# EAGLE design 455_audio (EAGLE 9.6.2)

## Sheet 1 of 2
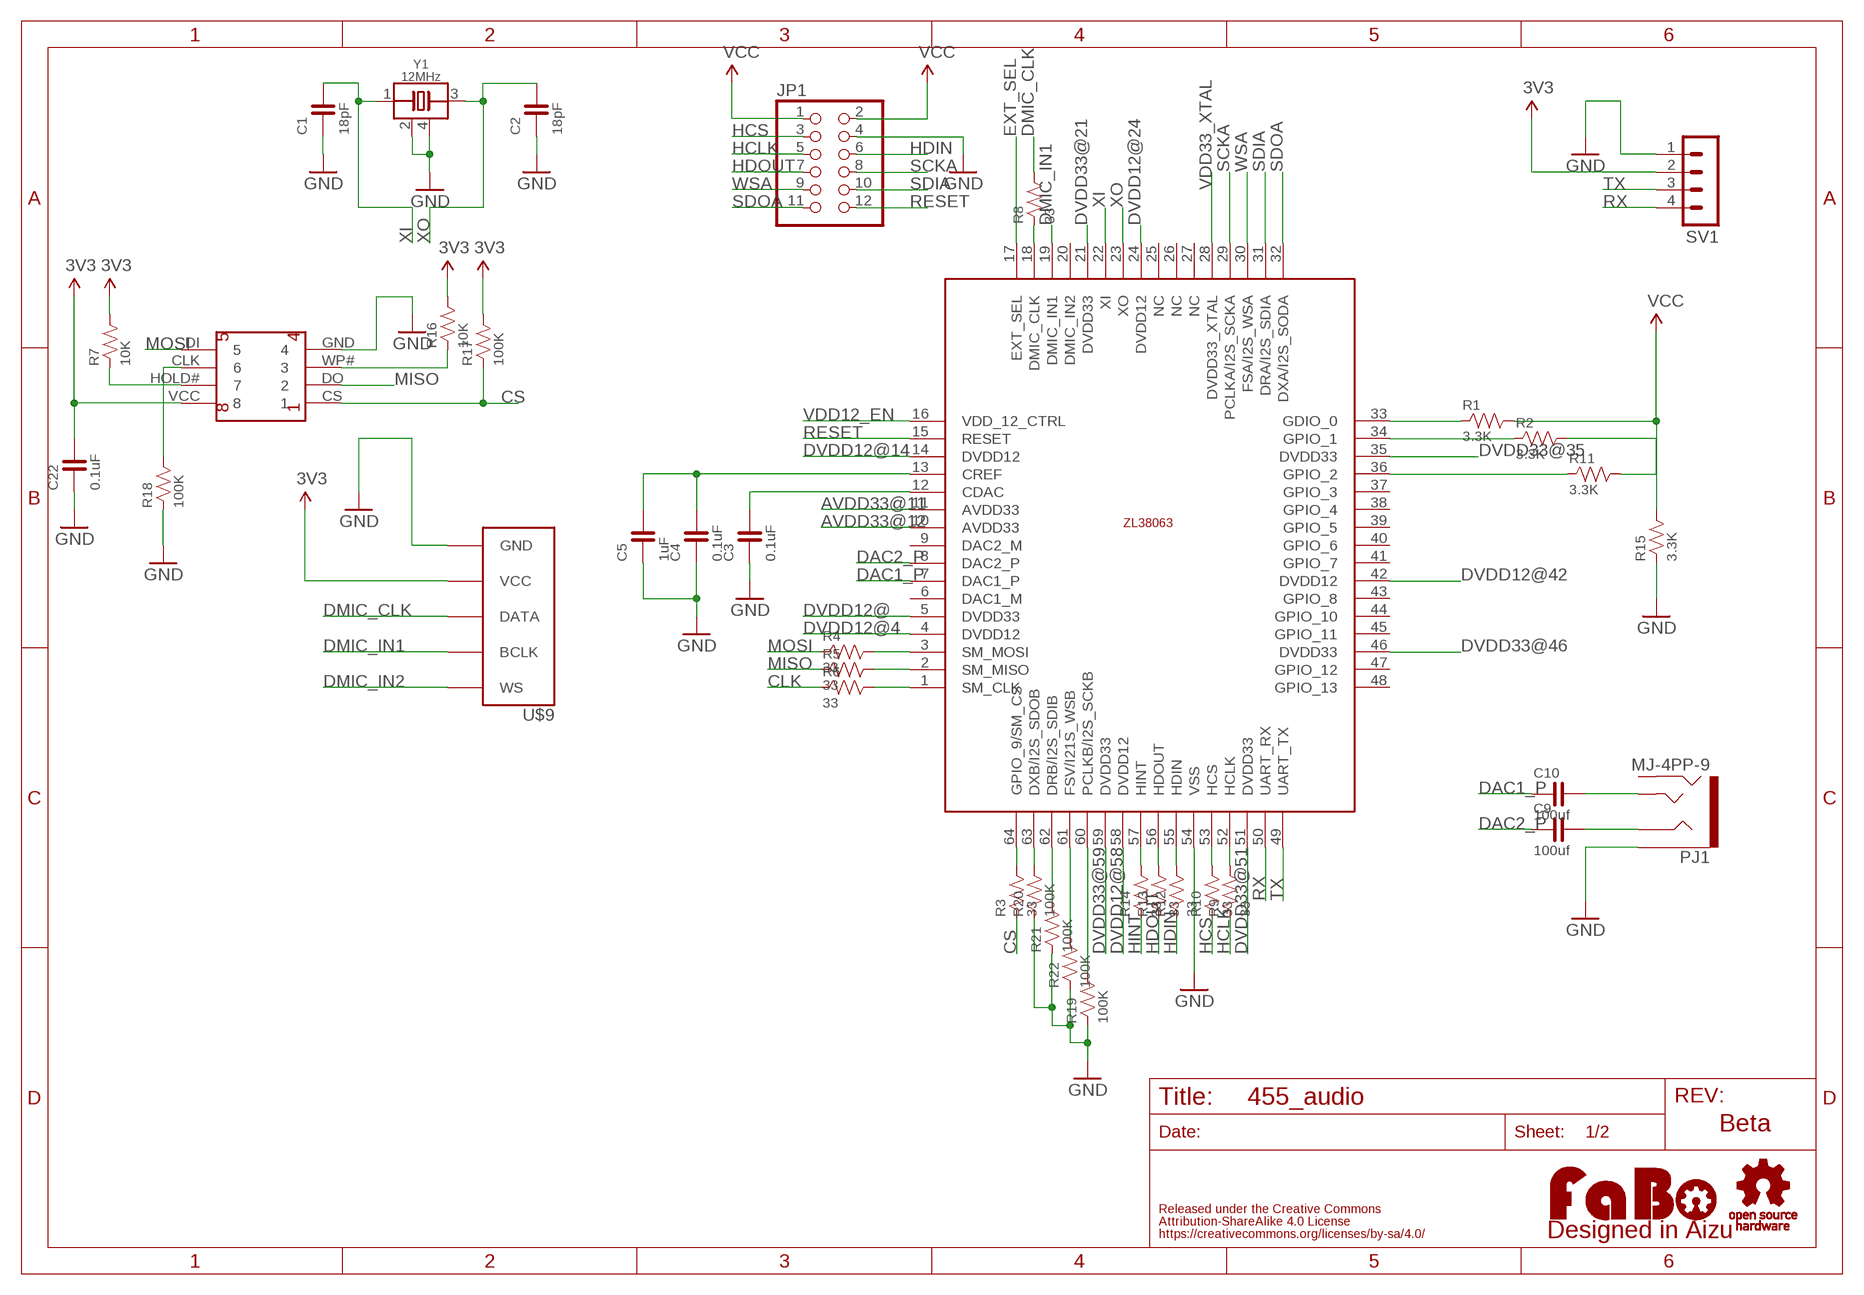
[diagram p0: schematic, sheet 1]

### Parts
C1  18pF  CAPACITOR-0603  [0603]
C2  18pF  CAPACITOR-0603  [0603]
C3  0.1uF  CAPACITOR-0603  [0603]
C4  0.1uF  CAPACITOR-0603  [0603]
C5  1uF  CAPACITOR-0603  [0603]
C9  100uf  CAPACITOR-0603  [0603]
C10  100uf  CAPACITOR-0603  [0603]
C22  0.1uF  CAPACITOR-0603  [0603]
JP1  PINHD-2X6  [2X06]
LOGO1  LOGO_FABO-M  [LOGO_FABO_M]
PJ1  MJ-4PP-9  [PHONEJACK-MJ-4PP-9]
R1  3.3K  RESISTOR-0603  [0603]
R2  3.3K  RESISTOR-0603  [0603]
R3  33  RESISTOR-0603  [0603]
R4  33  RESISTOR-0603  [0603]
R5  33  RESISTOR-0603  [0603]
R6  33  RESISTOR-0603  [0603]
R7  10K  RESISTOR-0603  [0603]
R8  33  RESISTOR-0603  [0603]
R9  33  RESISTOR-0603  [0603]
R10  33  RESISTOR-0603  [0603]
R11  3.3K  RESISTOR-0603  [0603]
R12  33  RESISTOR-0603  [0603]
R13  33  RESISTOR-0603  [0603]
R14  33  RESISTOR-0603  [0603]
R15  3.3K  RESISTOR-0603  [0603]
R16  10K  RESISTOR-0603  [0603]
R17  100K  RESISTOR-0603  [0603]
R18  100K  RESISTOR-0603  [0603]
R19  100K  RESISTOR-0603  [0603]
R20  100K  RESISTOR-0603  [0603]
R21  100K  RESISTOR-0603  [0603]
R22  100K  RESISTOR-0603  [0603]
SV1  MA04-1  [MA04-1]
U$2  ZL38063  [ZL38063]
U$5  LOGO_OSHW-M_BOTTOM  [LOGO_OSHW_M_BOTTOM]
U$6  FLASH-MEMORY-2M(WINBOND)  [FLASH-MEMORY-2M(WINBOND)]
U$9  FABO_BRICK_I2SLONG_BOTTOM  [FABO_BRICK_I2S_S05B-PASK-2_LONG_BOTTOM]
Y1  12MHz  CRYSTAL-ECS-120-12-33Q  [ECS-12MHZ]

### Nets
3V3: C22.2 R7.2 R16.2 R17.2 SV1.2 U$6.VCC U$9.VCC ; also sheet 2
AVDD33@11: U$2.11(AVDD33)
AVDD33@12: U$2.10(AVDD33)
CLK: R6.1 R18.2 U$6.CLK
CS: R3.1 R17.1 U$6.CS
DAC1_P: C10.1 U$2.7(DAC1_P)
DAC2_P: C9.1 U$2.8(DAC2_P)
DMIC_CLK: R8.2 U$9.DATA
DMIC_IN1: U$2.19(DMIC_IN1) U$9.BCLK
DMIC_IN2: U$9.WS
DVDD12@: U$2.5(DVDD33) ; also sheet 2
DVDD12@4: U$2.4(DVDD12) ; also sheet 2
DVDD12@14: U$2.14(DVDD12) ; also sheet 2
DVDD12@24: U$2.24(DVDD12) ; also sheet 2
DVDD12@42: U$2.42(DVDD12) ; also sheet 2
DVDD12@58: U$2.58(DVDD12) ; also sheet 2
DVDD33@21: U$2.21(DVDD33) ; also sheet 2
DVDD33@35: U$2.35(DVDD33) ; also sheet 2
DVDD33@46: U$2.46(DVDD33) ; also sheet 2
DVDD33@51: U$2.51(DVDD33) ; also sheet 2
DVDD33@59: U$2.59(DVDD33) ; also sheet 2
EXT_SEL: U$2.17(EXT_SEL) ; also sheet 2
GND: C1.1 C2.1 C3.1 C4.1 C5.1 C22.1 JP1.4 PJ1.A R15.1 R18.1 R19.1 R20.1 R21.1 R22.1 SV1.1 U$2.54(VSS) U$6.GND U$9.GND Y1.2(GND) Y1.4(GND) ; also sheet 2
HCLK: JP1.5 R9.1
HCS: JP1.3 R10.1
HDIN: JP1.6 R12.1
HDOUT: JP1.7 R13.1
HINT: R14.1
MISO: R5.1 U$6.DO
MOSI: R4.1 U$6.DI
N$1: R1.1 U$2.33(GDIO_0)
N$2: R2.1 U$2.34(GPIO_1)
N$3: C3.2 U$2.12(CDAC)
N$4: C4.2 C5.2 U$2.13(CREF)
N$5: R3.2 U$2.64(GPIO_9/SM_CS)
N$6: R20.2 U$2.63(DXB/I2S_SDOB)
N$7: R11.1 U$2.36(GPIO_2)
N$8: R5.2 U$2.2(SM_MISO)
N$9: R6.2 U$2.1(SM_CLK)
N$10: C9.2 PJ1.C
N$11: C10.2 PJ1.D
N$12: R4.2 U$2.3(SM_MOSI)
N$13: R8.1 U$2.18(DMIC_CLK)
N$14: R14.2 U$2.57(HINT)
N$15: R13.2 U$2.56(HDOUT)
N$16: R12.2 U$2.55(HDIN)
N$17: R10.2 U$2.53(HCS)
N$18: R9.2 U$2.52(HCLK)
N$19: R11.2 R15.2
N$20: R7.1 U$6.HOLD#
N$21: R16.1 U$6.WP#
N$22: R21.2 U$2.62(DRB/I2S_SDIB)
N$23: R22.2 U$2.61(FSV/I21S_WSB)
N$24: R19.2 U$2.60(PCLKB/I2S_SCKB)
RESET: JP1.12 U$2.15(RESET)
RX: SV1.4 U$2.50(UART_RX)
SCKA: JP1.8 U$2.29(PCLKA/I2S_SCKA)
SDIA: JP1.10 U$2.31(DRA/I2S_SDIA)
SDOA: JP1.11 U$2.32(DXA/I2S_SODA)
TX: SV1.3 U$2.49(UART_TX)
VCC: JP1.1 JP1.2 R1.2 R2.2 ; also sheet 2
VDD12_EN: U$2.16(VDD_12_CTRL) ; also sheet 2
VDD33_XTAL: U$2.28(DVDD33_XTAL)
WSA: JP1.9 U$2.30(FSA/I2S_WSA)
XI: C1.2 U$2.22(XI) Y1.1(IO)
XO: C2.2 U$2.23(XO) Y1.3(IO)
Unconnected: PJ1.B U$2.6(DAC1_M) U$2.9(DAC2_M) U$2.20(DMIC_IN2) U$2.25(NC) U$2.26(NC) U$2.27(NC) U$2.37(GPIO_3) U$2.38(GPIO_4) U$2.39(GPIO_5) U$2.40(GPIO_6) U$2.41(GPIO_7) U$2.43(GPIO_8) U$2.44(GPIO_10) U$2.45(GPIO_11) U$2.47(GPIO_12) U$2.48(GPIO_13)

### Notes on the sheet
- Beta

## Sheet 2 of 2
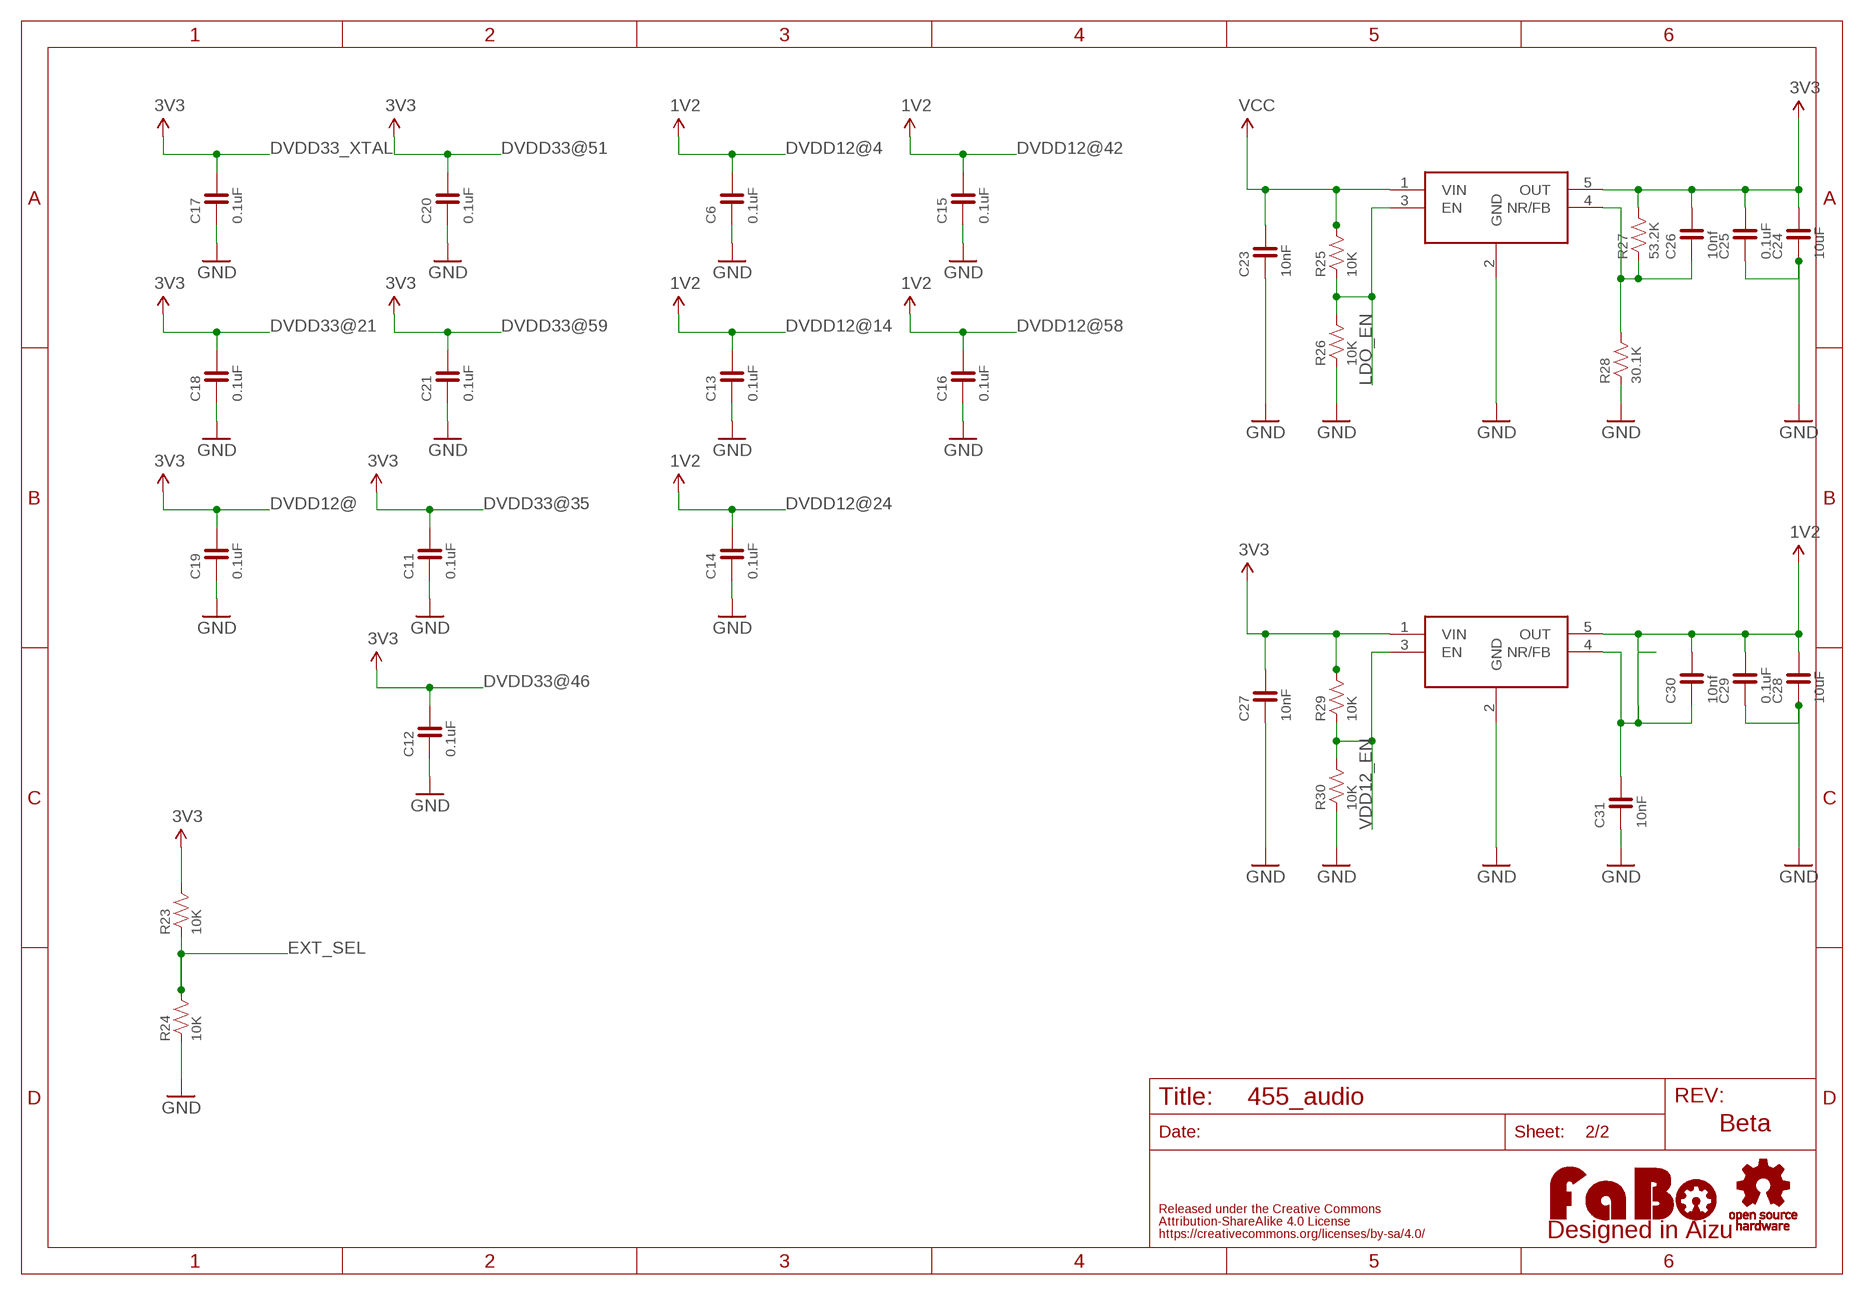
[diagram p1: schematic, sheet 2]

### Parts
C6  0.1uF  CAPACITOR-0603  [0603]
C11  0.1uF  CAPACITOR-0603  [0603]
C12  0.1uF  CAPACITOR-0603  [0603]
C13  0.1uF  CAPACITOR-0603  [0603]
C14  0.1uF  CAPACITOR-0603  [0603]
C15  0.1uF  CAPACITOR-0603  [0603]
C16  0.1uF  CAPACITOR-0603  [0603]
C17  0.1uF  CAPACITOR-0603  [0603]
C18  0.1uF  CAPACITOR-0603  [0603]
C19  0.1uF  CAPACITOR-0603  [0603]
C20  0.1uF  CAPACITOR-0603  [0603]
C21  0.1uF  CAPACITOR-0603  [0603]
C23  10nF  CAPACITOR-0603  [0603]
C24  10uF  CAPACITOR-0603  [0603]
C25  0.1uF  CAPACITOR-0603  [0603]
C26  10nf  CAPACITOR-0603  [0603]
C27  10nF  CAPACITOR-0603  [0603]
C28  10uF  CAPACITOR-0603  [0603]
C29  0.1uF  CAPACITOR-0603  [0603]
C30  10nf  CAPACITOR-0603  [0603]
C31  10nF  CAPACITOR-0603  [0603]
R23  10K  RESISTOR-0603  [0603]
R24  10K  RESISTOR-0603  [0603]
R25  10K  RESISTOR-0603  [0603]
R26  10K  RESISTOR-0603  [0603]
R27  53.2K  RESISTOR-0603  [0603]
R28  30.1K  RESISTOR-0603  [0603]
R29  10K  RESISTOR-0603  [0603]
R30  10K  RESISTOR-0603  [0603]
U$7  TPS73601  [SOT-23-5]
U$8  TPS73601  [SOT-23-5]

### Nets
1V8: C28.2 C29.2 C30.2 U$8.5(OUT) ; supply symbol labelled 1V2
3V3: C24.2 C25.2 C26.2 C27.2 R23.2 R27.2 R29.2 U$7.5(OUT) U$8.1(VIN) ; also sheet 1
DVDD12@: C19.2 ; supply symbol labelled 3V3 ; also sheet 1
DVDD12@4: C6.2 ; supply symbol labelled 1V2 ; also sheet 1
DVDD12@14: C13.2 ; supply symbol labelled 1V2 ; also sheet 1
DVDD12@24: C14.2 ; supply symbol labelled 1V2 ; also sheet 1
DVDD12@42: C15.2 ; supply symbol labelled 1V2 ; also sheet 1
DVDD12@58: C16.2 ; supply symbol labelled 1V2 ; also sheet 1
DVDD33@21: C18.2 ; supply symbol labelled 3V3 ; also sheet 1
DVDD33@35: C11.2 ; supply symbol labelled 3V3 ; also sheet 1
DVDD33@46: C12.2 ; supply symbol labelled 3V3 ; also sheet 1
DVDD33@51: C20.2 ; supply symbol labelled 3V3 ; also sheet 1
DVDD33@59: C21.2 ; supply symbol labelled 3V3 ; also sheet 1
DVDD33_XTAL: C17.2 ; supply symbol labelled 3V3
EXT_SEL: R23.1 R24.2 ; also sheet 1
GND: C6.1 C11.1 C12.1 C13.1 C14.1 C15.1 C16.1 C17.1 C18.1 C19.1 C20.1 C21.1 C23.1 C24.1 C25.1 C27.1 C28.1 C29.1 C31.1 R24.1 R26.1 R28.1 R30.1 U$7.2(GND) U$8.2(GND) ; also sheet 1
LDO_EN: R25.1 R26.2 U$7.3(EN)
N$25: C26.1 R27.1 R28.2 U$7.4(NR/FB)
N$27: C30.1 C31.2 U$8.4(NR/FB)
VCC: C23.2 R25.2 U$7.1(VIN) ; also sheet 1
VDD12_EN: R29.1 R30.2 U$8.3(EN) ; also sheet 1

### Notes on the sheet
- Beta

## Library data of the parts
C1-C6 C9-C31 = FaBo-Capacitor:CAPACITOR: CAPACITOR
JP1 = pinhead:PINHD-2X6: PIN HEADER
LOGO1 = component:LOGO_FABO
PJ1 = FaBo-Parts:MJ-4PP-9: 3.5mm PhoneJack 4 conductor MJ-4PP-9 http://akizukidenshi.com/download/ds/avvicon/MJ-4PP-9.pdf
R1-R30 = FaBo-Resistors:RESISTOR: RESISTOR
SV1 = con-lstb:MA04-1: PIN HEADER; OC_FARNELL: unknown; OC_NEWARK: unknown
U$2 = FaBo-Sound:ZL38063
U$5 = component:LOGO_OSHW
U$6 = FaBo-etc:FLASH-MEMORY-2M(WINBOND)
U$7 U$8 = FaBo-Supply:TPS73601
U$9 = FaBo-Template:FABO_BRICK_I2S
Y1 = FaBo-Crystal:CRYSTAL-ECS

## Board
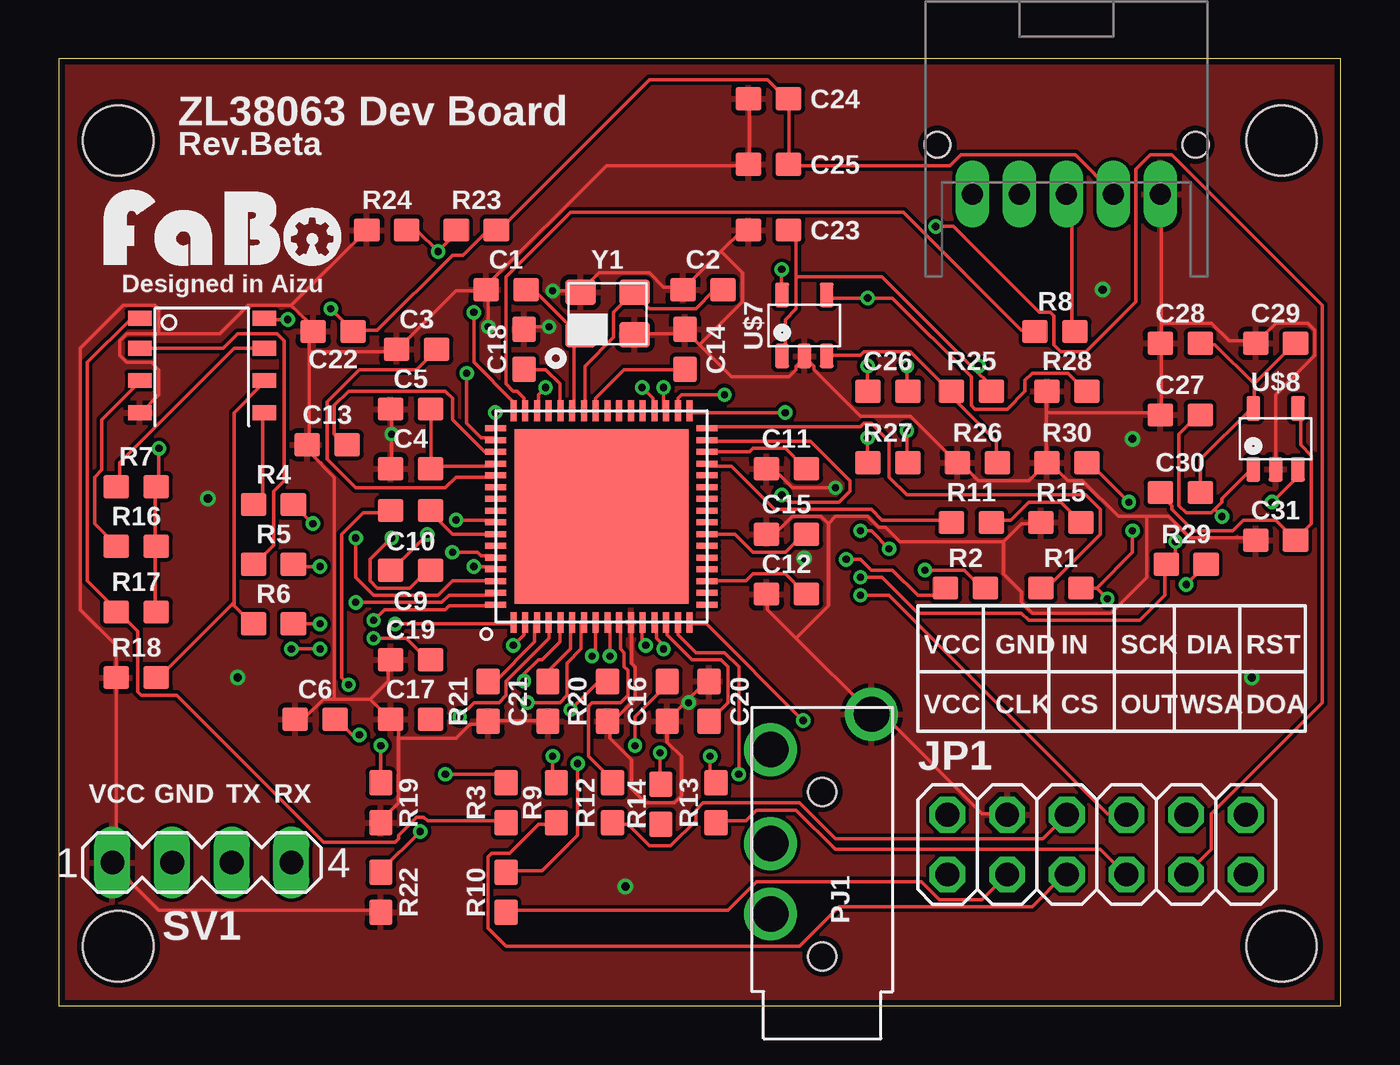
[diagram p2: board, top side]
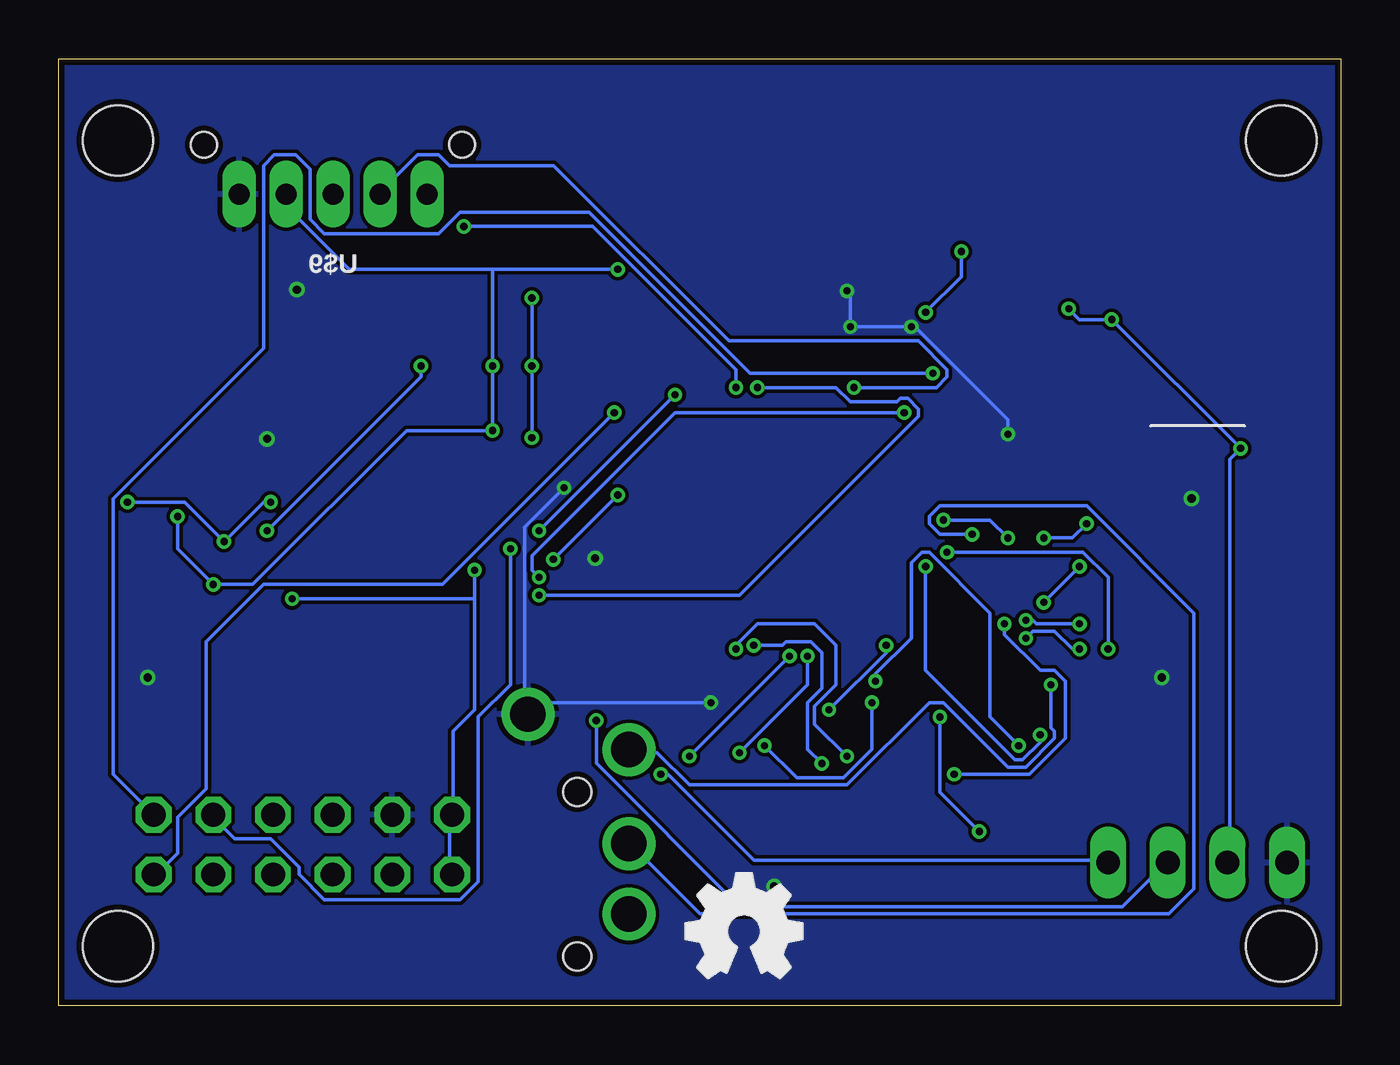
[diagram p3: board, bottom side, seen from below]

Size 54.59 x 40.31 mm. Coordinates in mm from the lower left corner, seen from the top.
Outline: 0,0 54.59,0 54.59,40.31 0,40.31 0,0
Copper layers (1*16): Top 0.035mm / dielectric 1.6mm / Bottom 0.035mm
Design rules "PCBway": minimum track width 6mil, minimum drill 12mil, track to track 6mil, track to pad 6mil, pad to pad 6mil, via to via 6mil, smd to smd 6mil, copper to edge 10mil, drill to drill 10mil, minimum pad ring 10mil, minimum via ring 6mil, stop-mask expansion 2mil, vias tented up to drill 100mil, thermal gap 8mil
Holes 3 mm at 2.54,2.54 2.54,36.83 52.07,36.83 52.07,2.54

### Footprints (pad centres in the part's own frame; a part is rotated, then mirrored left to right if it is on the bottom)
0603 = smd 1.1 x 1: 1 -0.85,0; 2 0.85,0
2X06 = drill 1.016 octagon: 1 -6.35,-1.27; 2 -6.35,1.27; 3 -3.81,-1.27; 4 -3.81,1.27; 5 -1.27,-1.27; 6 -1.27,1.27; 7 1.27,-1.27; 8 1.27,1.27; 9 3.81,-1.27; 10 3.81,1.27; 11 6.35,-1.27; 12 6.35,1.27
PHONEJACK-MJ-4PP-9 = drill 1.5: A 5.8,-2.1; B -2.7,2.2; C 0.3,2.2; D 4.3,2.2 | hole 1.2: -4.5,0; 2.5,0
MA04-1 = drill 1.016 long: 1 -3.81,0; 2 -1.27,0; 3 1.27,0; 4 3.81,0
ZL38063 = smd 0.889 x 0.254: 1 -4.51,-3.75; 2 -4.51,-3.25; 3 -4.51,-2.75; 4 -4.51,-2.25; 5 -4.51,-1.75; 6 -4.51,-1.25; 7 -4.51,-0.75; 8 -4.51,-0.25; 9 -4.51,0.25; 10 -4.51,0.75; 11 -4.51,1.25; 12 -4.51,1.75; 13 -4.51,2.25; 14 -4.51,2.75; 15 -4.51,3.25; 16 -4.51,3.75; 33 4.494,3.75; 34 4.494,3.25; 35 4.494,2.75; 36 4.494,2.25; 37 4.494,1.75; 38 4.494,1.25; 39 4.494,0.75; 40 4.494,0.25; 41 4.494,-0.25; 42 4.494,-0.75; 43 4.494,-1.25; 44 4.494,-1.75; 45 4.494,-2.25; 46 4.494,-2.75; 47 4.494,-3.25; 48 4.494,-3.75 | smd 0.254 x 0.889: 17 -3.75,4.5; 18 -3.25,4.5; 19 -2.75,4.5; 20 -2.25,4.5; 21 -1.75,4.5; 22 -1.25,4.5; 23 -0.75,4.5; 24 -0.25,4.5; 25 0.25,4.5; 26 0.75,4.5; 27 1.25,4.5; 28 1.75,4.5; 29 2.25,4.5; 30 2.75,4.5; 31 3.25,4.5; 32 3.75,4.5; 49 3.75,-4.514; 50 3.25,-4.514; 51 2.75,-4.514; 52 2.25,-4.514; 53 1.75,-4.514; 54 1.25,-4.514; 55 0.75,-4.514; 56 0.25,-4.514; 57 -0.25,-4.514; 58 -0.75,-4.514; 59 -1.25,-4.514; 60 -1.75,-4.514; 61 -2.25,-4.514; 62 -2.75,-4.514; 63 -3.25,-4.514; 64 -3.75,-4.514 | smd 0.33 x 0.33: P$1 -3.165,3.165; P$3 -2.54,3.165; P$4 -1.915,3.165; P$5 -1.29,3.165; P$6 -0.665,3.165; P$7 -0.04,3.165; P$8 0.585,3.165; P$9 1.21,3.165; P$10 1.835,3.165; P$11 2.46,3.165; P$12 3.085,3.165; P$13 -3.165,2.54; P$14 -2.54,2.54; P$15 -1.915,2.54; P$16 -1.29,2.54; P$17 -0.665,2.54; P$18 -0.04,2.54; P$19 0.585,2.54; P$20 1.21,2.54; P$21 1.835,2.54; P$22 2.46,2.54; P$23 3.085,2.54; P$24 -3.165,1.915; P$25 -2.54,1.915; P$26 -1.915,1.915; P$27 -1.29,1.915; P$28 -0.665,1.915; P$29 -0.04,1.915; P$30 0.585,1.915; P$31 1.21,1.915; P$32 1.835,1.915; P$33 2.46,1.915; P$34 3.085,1.915; P$35 -3.165,1.29; P$36 -2.54,1.29; P$37 -1.915,1.29; P$38 -1.29,1.29; P$39 -0.665,1.29; P$40 -0.04,1.29; P$41 0.585,1.29; P$42 1.21,1.29; P$43 1.835,1.29; P$44 2.46,1.29; P$45 3.085,1.29; P$46 -3.165,0.665; P$47 -2.54,0.665; P$48 -1.915,0.665; P$49 -1.29,0.665; P$50 -0.665,0.665; P$51 -0.04,0.665; P$52 0.585,0.665; P$53 1.21,0.665; P$54 1.835,0.665; P$55 2.46,0.665; P$56 3.085,0.665; P$57 -3.165,0.04; P$58 -2.54,0.04; P$59 -1.915,0.04; P$60 -1.29,0.04; P$61 -0.665,0.04; P$62 -0.04,0.04; P$63 0.585,0.04; P$64 1.21,0.04; P$65 1.835,0.04; P$66 2.46,0.04; P$67 3.085,0.04; P$68 -3.165,-0.585; P$69 -2.54,-0.585; P$70 -1.915,-0.585; P$71 -1.29,-0.585; P$72 -0.665,-0.585; P$73 -0.04,-0.585; P$74 0.585,-0.585; P$75 1.21,-0.585; P$76 1.835,-0.585; P$77 2.46,-0.585; P$78 3.085,-0.585; P$79 -3.165,-1.21; P$80 -2.54,-1.21; P$81 -1.915,-1.21; P$82 -1.29,-1.21; P$83 -0.665,-1.21; P$84 -0.04,-1.21; P$85 0.585,-1.21; P$86 1.21,-1.21; P$87 1.835,-1.21; P$88 2.46,-1.21; P$89 3.085,-1.21; P$90 -3.165,-1.835; P$91 -2.54,-1.835; P$92 -1.915,-1.835; P$93 -1.29,-1.835; P$94 -0.665,-1.835; P$95 -0.04,-1.835; P$96 0.585,-1.835; P$97 1.21,-1.835; P$98 1.835,-1.835; P$99 2.46,-1.835; P$100 3.085,-1.835; P$101 -3.165,-2.46; P$102 -2.54,-2.46; P$103 -1.915,-2.46; P$104 -1.29,-2.46; P$105 -0.665,-2.46; P$106 -0.04,-2.46; P$107 0.585,-2.46; P$108 1.21,-2.46; P$109 1.835,-2.46; P$110 2.46,-2.46; P$111 3.085,-2.46; P$112 -3.165,-3.085; P$113 -2.54,-3.085; P$114 -1.915,-3.085; P$115 -1.29,-3.085; P$116 -0.665,-3.085; P$117 -0.04,-3.085; P$118 0.585,-3.085; P$119 1.21,-3.085; P$120 1.835,-3.085; P$121 2.46,-3.085; P$122 3.085,-3.085 | smd 7.42 x 7.42: P$2 0,0
FLASH-MEMORY-2M(WINBOND) = smd 1 x 0.635: CLK 2.67,0.2; CS -2.64,2.84; DI 2.67,-1.17; DO -2.64,1.57; GND -2.64,-1.17; HOLD# 2.67,1.57; VCC 2.67,2.84; WP# -2.64,0.2
SOT-23-5 = smd 0.6 x 1.05: 1 -0.95,-1.3; 2 0,-1.3; 3 0.95,-1.3; 4 0.95,1.3; 5 -0.95,1.3
FABO_BRICK_I2S_S05B-PASK-2_LONG_BOTTOM = drill 0.9 pad 1.422 long: BCLK -2.27,-3.81; DATA -0.27,-3.81; GND 3.73,-3.81; VCC 1.73,-3.81; WS -4.27,-3.81 | hole 1.1: 5.23,-1.71; -5.77,-1.71
ECS-12MHZ = smd 1.3 x 1.1: 1 -1.15,-0.9; 2 1.15,-0.9; 3 1.15,0.9; 4 -1.15,0.9

### Placement (x,y rotation side)
C1  19.05,30.48 0 top
C2  27.43,30.48 0 top
C3  15.24,27.94 0 top
C4  14.99,22.86 0 top
C5  14.99,25.4 0 top
C6  10.92,12.19 0 top
C9  14.99,18.54 180 top
C10  14.99,21.08 180 top
C11  30.99,22.86 0 top
C12  30.99,17.53 0 top
C13  11.43,23.88 0 top
C14  26.67,27.94 270 top
C15  30.99,20.07 0 top
C16  25.91,12.95 90 top
C17  14.99,12.19 0 top
C18  19.81,27.94 270 top
C19  14.99,14.73 0 top
C20  27.69,12.95 270 top
C21  20.83,12.95 90 top
C22  11.68,28.7 0 top
C23  30.23,33.02 0 top
C24  30.23,38.61 0 top
C25  30.23,35.81 0 top
C26  35.31,26.16 0 top
C27  47.75,25.15 0 top
C28  47.75,28.19 0 top
C29  51.82,28.19 0 top
C30  47.75,21.84 0 top
C31  51.82,19.81 0 top
JP1  44.2,6.86 0 top
LOGO1  6.99,31.11 0 top
PJ1  32.51,6.6 90 top
R1  42.67,17.78 0 top
R2  38.61,17.78 0 top
R3  19.05,8.64 90 top
R4  9.14,21.34 0 top
R5  9.14,18.8 0 top
R6  9.14,16.26 0 top
R7  3.3,22.1 0 top
R8  42.42,28.7 0 top
R9  21.19,8.64 90 top
R10  19.05,4.83 90 top
R11  38.86,20.57 0 top
R12  23.58,8.64 90 top
R13  27.99,8.64 90 top
R14  25.64,8.58 90 top
R15  42.67,20.57 0 top
R16  3.3,19.56 0 top
R17  3.3,16.76 0 top
R18  3.3,13.97 0 top
R19  13.72,8.64 90 top
R20  23.37,12.95 90 top
R21  18.29,12.95 90 top
R22  13.72,4.83 90 top
R23  17.78,33.02 0 top
R24  13.97,33.02 0 top
R25  38.86,26.16 0 top
R26  39.12,23.11 0 top
R27  35.31,23.11 0 top
R28  42.93,26.16 0 top
R29  48.01,18.8 0 top
R30  42.93,23.11 0 top
SV1  6.1,6.1 0 top
U$2  23.11,20.83 0 top
U$5  25.4,3.17 0 top
U$6  6.1,26.42 0 top
U$7  31.75,28.96 0 top
U$8  51.82,24.13 0 top
U$9  43.18,38.35 0 top
Y1  23.37,29.46 0 top

### Tracks (layer width: path | path; a pad name or v marks a point on that pad's centre or on a via)
1V8
  Top 0.152: 50.9,26.47 50.9,25.55 U$8.5 50.75,25.4 48.62,23.27 48.62,21.89 C30.2 | 50.9,26.47 52.58,28.14 C29.2 | 50.9,26.47 49.23,28.14 48.62,28.14 C28.2
3V3  (via drill 0.3)
  Top 0.152: 49.23,21.13 49.07,20.98 48.01,20.98 47.7,21.29 47.7,24.33 48.46,25.09 C27.2 | 49.23,21.13 49.53,21.44 49.53,21.59 50.75,22.81 U$8.1 | v30.79,31.34 30.79,30.28 U$7.5 | v36.12,24.49 36.12,23.11 R27.2 | v36.12,27.23 36.12,26.16 C26.2 | v48.01,17.93 48.77,18.69 R29.2 | U$9.VCC 44.96,34.54 43.28,36.22 38.41,36.22 37.95,35.76 31.09,35.76 C25.2 31.09,35.92 31.09,38.51 C24.2 30.94,38.66 30.18,39.42 25.15,39.42 18.75,33.02 R23.2 18.59,33.02 18.29,33.02 17.22,31.95 16.76,31.95 13.56,28.75 12.65,28.75 C22.2 12.5,28.75 v11.58,29.67 | v49.53,20.83 49.23,21.13 | R17.2 4.12,16.87 4.12,19.46 R16.2 4.12,19.61 4.12,22.05 R7.2 4.27,22.2 v4.27,23.72 | v9.75,29.21 8.84,29.21 U$6.VCC
  Bottom 0.152: 36.12,31.34 42.22,31.34 44.81,33.93 44.81,34.54 U$9.VCC | 36.12,31.34 v30.79,31.34 | 36.12,31.34 v36.12,27.23 v36.12,24.49 39.78,24.49 46.33,17.93 v48.01,17.93 49.53,19.46 v49.53,20.83 | v11.58,29.67 11.12,29.21 v9.75,29.21 v4.27,23.72 4.72,23.27 4.72,6.2 SV1.2
CLK
  Top 0.152: 7.47,17.17 7.47,17.02 8.23,16.26 R6.1 | 7.47,17.17 7.47,25.25 8.69,26.47 U$6.CLK | 7.47,17.17 4.27,13.97 R18.2
CS
  Top 0.152: U$6.CS 3.35,29.21 3.05,29.21 1.22,27.38 1.22,18.09 2.44,16.87 R17.1 2.59,16.71 3.35,15.95 3.35,13.36 3.5,13.21 5.03,13.21 11.28,6.96 14.33,6.96 14.48,7.11 14.48,7.26 15.24,8.03 15.54,8.03 15.7,7.87 19.05,7.87 R3.1
DAC1_P
  Top 0.152: U$2.7 18.59,20.07 16.76,20.07 15.85,20.98 C10.1
DAC2_P  (via drill 0.3)
  Top 0.152: v16.92,20.68 18.59,20.68 U$2.8 | v14.17,19.91 13.26,19 13.26,18.09 13.56,17.78 14.94,17.78 15.7,18.54 C9.1
  Bottom 0.152: v16.92,20.68 14.94,20.68 v14.17,19.91
DMIC_CLK
  Top 0.152: R8.2 43.13,28.75 43.13,34.39 42.98,34.54 U$9.DATA
DMIC_IN1  (via drill 0.3)
  Top 0.152: v20.73,26.31 20.42,26.01 20.42,25.4 U$2.19
  Bottom 0.152: v20.73,26.31 17.22,26.31 16.76,26.77 16.76,27.08 17.98,28.3 26.06,28.3 33.53,35.76 37.95,35.76 38.41,36.22 39.32,36.22 41,34.54 U$9.BCLK
DVDD12@  (via drill 0.3)
  Top 0.152: v16.76,19.3 17.83,19.3 17.98,19.15 18.59,19.15 U$2.5 | v11.12,15.19 v9.91,15.19 | v13.41,15.65 14.78,15.65 15.7,14.73 C19.2
  Bottom 0.152: v16.76,19.3 10.97,19.3 9.91,18.24 v9.91,15.19 | v11.12,15.19 11.43,15.19 12.19,15.95 13.11,15.95 v13.41,15.65
DVDD12@4  (via drill 0.3)
  Top 0.152: v17.68,18.69 18.59,18.69 U$2.4 | v12.8,11.53 12.5,11.53 11.89,12.14 C6.2
  Bottom 0.152: v17.68,18.69 17.68,14.27 13.87,10.46 13.56,10.46 12.8,11.23 v12.8,11.53
DVDD12@14
  Top 0.152: U$2.14 18.14,23.57 16.76,24.94 16.76,25.86 16.46,26.16 12.34,26.16 11.73,25.55 11.73,24.33 12.19,23.88 C13.2
DVDD12@24
  Top 0.152: U$2.24 22.86,25.4 22.86,25.86 24.08,27.08 26.67,27.08 C14.2
DVDD12@42
  Top 0.152: U$2.42 27.74,20.07 28.8,20.07 29.57,19.3 30.94,19.3 31.7,20.07 C15.2
DVDD12@58  (via drill 0.3)
  Top 0.152: v19.96,12.9 21.34,12.9 21.64,13.21 21.64,14.58 22.25,15.19 22.25,16.26 U$2.58 | v24.54,11.07 24.54,12.29 25.91,13.66 C16.2
  Bottom 0.152: v19.96,12.9 19.96,10.92 21.18,9.7 23.16,9.7 v24.54,11.07
DVDD33@21
  Top 0.152: U$2.21 21.34,25.4 21.34,26.47 20.73,27.08 19.81,27.08 C18.2
DVDD33@35
  Top 0.152: U$2.35 27.74,23.57 29.41,23.57 29.57,23.72 30.94,23.72 31.7,22.96 C11.2
DVDD33@46
  Top 0.152: U$2.46 27.74,18.09 29.26,18.09 29.57,18.39 30.94,18.39 31.7,17.63 C12.2
DVDD33@51
  Top 0.152: U$2.51 25.91,16.26 25.91,15.8 26.98,14.73 28.19,14.73 28.5,14.43 28.5,12.9 27.74,12.14 C20.2
DVDD33@59
  Top 0.152: U$2.59 21.79,16.26 21.79,15.19 20.88,14.27 20.88,13.82 C21.2
EXT_SEL  (via drill 0.3)
  Top 0.152: v17.68,29.52 17.68,27.38 19.36,25.7 19.36,25.4 U$2.17 | R23.1 17.07,33.02 v16.15,32.11 15.24,33.02 14.94,33.02 R24.2
  Bottom 0.152: v17.68,29.52 16.15,31.04 v16.15,32.11
GND  (via drill 0.3, 0.35)
  Top 0.152: R22.1 13.72,4.06 4.27,4.06 2.29,6.04 SV1.1 2.29,6.2 2.44,6.35 2.44,13.97 | 2.44,13.97 R18.1 2.44,13.97 | C21.1 20.73,12.14 18.29,12.14 R21.1 18.29,11.99 17.53,11.99 16.92,11.38 14.48,11.38 | 13.26,13.06 11.73,13.06 | 11.73,13.06 11.28,13.06 10.52,12.29 10.21,12.29 C6.1 | 13.26,13.06 14.02,12.29 C17.1 14.17,12.14 14.48,11.84 14.48,11.38 | 14.48,11.38 14.48,8.64 13.72,7.87 R19.1 | 13.26,13.06 14.02,13.82 14.02,14.73 C19.1 | C24.1 29.41,38.51 29.41,35.92 C25.1 29.26,35.76 23.32,35.76 18.14,30.58 C1.1 | 4.27,28.6 6.86,28.6 8.08,29.82 9.91,29.82 | 4.27,28.6 2.9,28.6 2.59,28.3 2.59,27.69 2.9,27.38 3.96,27.38 4.27,27.08 4.27,26.01 3.5,25.25 U$6.GND | 9.91,29.82 10.97,28.75 C22.1 10.82,28.6 10.67,28.45 10.67,27.84 | 10.67,27.84 10.67,23.88 | 10.67,23.88 C13.1 10.67,23.88 | 10.67,27.84 14.33,27.84 C3.1 14.48,27.99 16.92,30.43 18.14,30.43 C1.1 | 9.91,29.82 13.11,33.02 R24.1 | 11.73,13.06 11.73,22.5 10.67,23.57 10.67,23.88 | 2.44,13.97 2.44,15.34 0.91,16.87 0.91,27.99 2.74,29.82 4.12,29.82 4.27,29.67 4.27,28.6 | 26.82,13.06 27.58,13.82 C20.1 | 26.82,13.06 25.91,12.14 C16.1 25.91,11.99 25.91,11.23 26.52,10.62 26.52,8.94 26.21,8.64 24.99,8.64 24.38,9.25 24.38,10.46 23.47,11.38 23.47,11.99 | 23.47,11.99 24.54,13.06 24.54,14.43 24.38,14.58 24.38,16.26 U$2.54 | 23.47,11.99 R20.1 23.47,11.99 | 31.39,15.65 34.59,12.45 PJ1.A 34.75,12.29 35.2,12.29 39.32,8.18 40.39,8.18 JP1.4 | 31.39,15.65 30.18,16.87 30.18,17.48 C12.1 | 32.77,20.52 32.46,20.83 31.24,20.83 30.48,20.07 30.18,20.07 C15.1 | 32.77,20.52 32.77,17.02 31.39,15.65 | v33.07,22.05 31.24,22.05 30.48,22.81 30.18,22.81 C11.1
  Top 0.152: 40.23,19.76 41,20.52 41.76,20.52 R15.1 | 40.23,19.76 35.81,19.76 35.2,20.37 34.9,20.37 34.44,20.83 33.07,20.83 32.77,20.52 | v26.82,12.9 26.82,13.06 | 26.82,28.6 26.67,28.75 C14.1 26.82,28.6 | 26.82,28.6 27.28,28.14 | 27.28,28.14 28.65,26.77 31.09,26.77 31.39,27.08 31.39,27.23 31.7,27.53 U$7.2 31.85,27.53 32.16,27.23 32.16,27.08 34.14,25.09 36.27,25.09 38.25,23.11 R26.1 38.41,23.11 39.17,22.35 41.3,22.35 42.06,23.11 | 26.82,28.6 24.54,28.6 Y1.2 | 28.19,32.11 29.11,33.02 29.26,33.02 C23.1 | 28.19,32.11 26.67,30.58 C2.1 26.52,30.58 25.76,30.58 25.15,31.19 23.01,31.19 22.25,30.43 Y1.4 22.1,30.43 v21.03,30.43 | C4.1 14.17,22.96 v14.17,24.33 14.17,25.4 C5.1 | v20.88,28.9 19.81,28.9 C18.1 | 27.28,28.14 29.11,29.97 29.11,31.19 28.19,32.11 | U$8.2 51.82,22.96 51.82,26.01 53.49,27.69 53.49,28.75 53.19,29.06 51.82,29.06 51.05,28.3 C29.1 50.9,28.3 49.84,28.3 49.07,29.06 46.94,29.06 | 42.06,23.11 R30.1 | 46.33,20.83 45.11,20.83 43.59,22.35 42.98,22.35 42.22,23.11 R30.1 | 46.33,20.83 47.24,20.83 48.16,19.91 50.9,19.91 C31.1 | 42.06,23.11 42.06,25.25 | 42.06,25.25 42.06,26.16 R28.1 | 42.06,23.11 R30.1 | 42.06,25.25 46.79,25.25 C27.1 46.94,25.25 46.94,28.14 C28.1 46.94,28.3 46.94,29.06 | 46.94,29.06 46.94,34.54 U$9.GND | 40.23,19.76 40.23,18.39 41,17.63 41,17.17 41.45,16.71 44.81,16.71 46.33,18.24 46.33,20.83 | v18.29,28.9 18.29,30.43 C1.1
  Bottom 0.152: v33.07,22.05 34.75,20.37 34.75,12.9 | 34.75,12.9 34.75,12.45 PJ1.A 34.75,12.9 | 34.75,12.9 v26.82,12.9 | v21.03,30.43 20.88,30.28 v20.88,28.9 v18.29,28.9 18.14,28.9 14.17,24.94 v14.17,24.33
  other vias: 6.35,21.59 24.13,5.08 7.62,13.97 45.72,24.13 44.45,30.48 50.8,13.97 31.75,19.05
  pour Bottom: 0,0 0,40.64 54.61,40.64 54.61,0
  pour Top: 0,0 0,40.64 54.61,40.64 54.61,0
HCLK
  Top 0.152: R9.1 21.18,7.72 20.42,7.72 19.2,6.5 18.44,6.5 18.29,6.35 18.29,3.3 19.05,2.54 31.55,2.54 33.22,4.22 41.45,4.22 42.82,5.59 JP1.5
HCS
  Top 0.152: JP1.3 39.32,4.52 37.49,4.52 36.73,5.28 29.72,5.28 28.5,4.06 19.05,4.06 R10.1
HDIN
  Top 0.152: R12.1 23.62,7.72 24.23,7.72 25.15,6.81 26.06,6.81 27.13,7.87 27.13,8.33 27.43,8.64 31.55,8.64 33.07,7.11 41.91,7.11 42.82,8.03 JP1.6
HDOUT
  Top 0.152: R13.1 28.04,7.87 29.26,7.87 29.72,8.33 31.39,8.33 33.07,6.66 44.35,6.66 45.41,5.59 JP1.7
LDO_EN
  Top 0.152: U$7.3 32.77,27.69 34.14,27.69 34.29,27.84 36.27,27.84 37.95,26.16 R25.1 38.1,26.16 38.1,25.86 39.93,24.03 39.93,23.11 R26.2
MISO
  Top 0.152: U$6.DO 3.5,27.99 7.01,27.99 7.62,28.6 9.3,28.6 9.6,28.3 9.6,22.35 9.14,21.89 9.14,19.61 8.38,18.85 R5.1
MOSI
  Top 0.152: U$6.DI 8.69,25.09 8.69,21.74 8.38,21.44 R4.1
N$1
  Top 0.152: U$2.33 27.74,24.64 34.14,24.64 34.29,24.79 34.59,24.79 35.36,24.03 35.36,22.5 36.12,21.74 43.74,21.74 44.35,21.13 44.35,20.07 42.06,17.78 41.91,17.78 R1.1
N$2  (via drill 0.3)
  Top 0.152: v30.79,21.74 31.09,21.44 33.22,21.44 33.68,21.89 33.68,22.35 32,24.03 27.74,24.03 U$2.34 | v33.53,19 34.14,19 34.59,18.54 35.51,18.54 36.58,17.48 37.34,17.48 37.64,17.78 R2.1
  Bottom 0.152: v33.53,19 v30.79,21.74
N$3
  Top 0.152: U$2.12 18.59,22.5 16.92,22.5 16.46,22.05 12.65,22.05 11.43,23.27 11.43,25.7 12.8,27.08 15.24,27.08 16,27.84 C3.2
N$4
  Top 0.152: 15.85,22.96 18.59,22.96 U$2.13 | 15.85,22.96 C4.2 15.85,22.96 | 15.85,22.96 C5.2
N$5  (via drill 0.3)
  Top 0.152: v14.33,16.26 19.36,16.26 U$2.64 | v16.46,9.86 18.75,9.86 19.05,9.55 R3.2
  Bottom 0.152: v14.33,16.26 14.33,15.8 12.8,14.27 12.19,14.27 11.73,13.82 11.73,11.38 13.26,9.86 v16.46,9.86
N$6  (via drill 0.3)
  Top 0.152: v19.36,15.34 19.81,15.8 19.81,16.26 U$2.63 | v21.79,12.6 22.86,13.66 23.32,13.66 R20.2
  Bottom 0.152: v19.36,15.34 19.36,15.04 v21.79,12.6
N$7
  Top 0.152: U$2.36 27.74,22.96 28.65,22.96 30.48,21.13 34.59,21.13 35.05,20.68 37.95,20.68 R11.1
N$8  (via drill 0.3)
  Top 0.152: v12.65,17.17 16.31,17.17 16.61,17.48 18.59,17.48 U$2.2 | v11.12,18.69 10.06,18.69 R5.2
  Bottom 0.152: v11.12,18.69 v12.65,17.17
N$9  (via drill 0.3)
  Top 0.152: v13.41,16.41 13.87,16.87 16.46,16.87 16.61,17.02 18.59,17.02 U$2.1 | v11.12,16.26 10.06,16.26 R6.2
  Bottom 0.152: v13.41,16.41 13.11,16.41 12.95,16.26 v11.12,16.26
N$10  (via drill 0.3)
  Top 0.152: v15.7,20.07 14.17,18.54 C9.2
  Bottom 0.152: v15.7,20.07 17.07,20.07 17.53,20.52 17.53,20.83 17.07,21.29 10.82,21.29 6.25,16.71 6.25,4.98 7.32,3.91 27.28,3.91 30.18,6.81 PJ1.C
N$11  (via drill 0.3)
  Top 0.152: v12.34,13.66 12.04,13.97 12.04,20.07 12.95,20.98 14.02,20.98 C10.2
  Bottom 0.152: v12.34,13.66 12.34,11.84 12.19,11.68 12.19,11.38 13.41,10.16 14.17,10.16 16.92,12.9 17.53,12.9 21.03,9.4 27.74,9.4 29.11,10.77 30.18,10.77 PJ1.D
N$12  (via drill 0.3)
  Top 0.152: v12.65,19.91 12.65,18.24 13.41,17.48 16.15,17.48 16.76,18.09 U$2.3 | v10.82,20.52 10.06,21.29 R4.2
  Bottom 0.152: v12.65,19.91 11.43,19.91 v10.82,20.52
N$13
  Top 0.152: U$2.18 19.81,25.4 19.81,25.86 19.51,26.16 19.36,26.16 19.05,26.47 19.05,31.04 21.79,33.78 35.97,33.78 41,28.75 41.45,28.75 R8.1
N$14  (via drill 0.3)
  Top 0.152: v22.71,14.88 22.86,15.04 22.86,16.26 U$2.57 | v25.6,10.77 25.6,9.55 R14.2
  Bottom 0.152: v22.71,14.88 22.71,13.66 v25.6,10.77
N$15  (via drill 0.3)
  Top 0.152: v23.47,14.88 23.47,16.26 U$2.56 | v27.74,10.62 27.74,9.7 27.89,9.55 R13.2
  Bottom 0.152: v27.74,10.62 v23.47,14.88
N$16
  Top 0.152: U$2.55 23.93,16.26 23.93,15.19 24.08,15.04 24.08,14.43 24.23,14.27 24.23,13.21 23.93,12.9 22.71,12.9 22.55,12.75 22.55,10.62 23.62,9.55 R12.2
N$17  (via drill 0.3)
  Top 0.152: v24.99,15.34 24.84,15.49 24.84,16.26 U$2.53 | v22.1,10.31 22.1,7.26 20.57,5.74 19.05,5.74 R10.2
  Bottom 0.152: v24.99,15.34 23.77,15.34 23.62,15.49 22.55,15.49 22.1,15.04 22.1,13.51 22.71,12.9 22.71,10.92 v22.1,10.31
N$18  (via drill 0.3)
  Top 0.152: v25.76,15.19 25.76,15.34 25.45,15.65 25.45,16.26 U$2.52 | v21.03,10.62 21.03,9.7 21.18,9.55 R9.2
  Bottom 0.152: v25.76,15.19 25.76,15.34 24.84,16.26 22.4,16.26 21.49,15.34 21.49,13.66 22.4,12.75 22.4,11.99 v21.03,10.62
N$19
  Top 0.152: R11.2 39.78,20.68 40.54,20.68 41.3,21.44 42.67,21.44 43.43,20.68 R15.2
N$20
  Top 0.152: U$6.HOLD# 8.69,27.99 7.47,27.99 2.59,23.11 2.59,22.2 R7.1
N$21
  Top 0.152: U$6.WP# 3.35,26.47 1.83,24.94 1.83,22.81 1.52,22.5 1.52,20.52 2.44,19.61 R16.1
N$22
  Top 0.152: U$2.62 20.27,16.26 20.27,15.49 18.59,13.82 18.29,13.82 R21.2
N$23  (via drill 0.3)
  Top 0.152: v17.07,12.29 17.68,12.9 18.75,12.9 19.05,13.21 19.05,13.82 20.88,15.65 20.88,16.26 U$2.61 | v15.39,7.42 13.72,5.74 R22.2
  Bottom 0.152: v17.07,12.29 17.07,9.09 v15.39,7.42
N$24  (via drill 0.3)
  Top 0.152: v19.81,13.82 19.81,14.12 20.42,14.73 20.57,14.73 21.34,15.49 21.34,16.26 U$2.60 | v13.72,11.07 13.72,9.55 R19.2
  Bottom 0.152: v19.81,13.82 19.81,14.12 18.29,15.65 18.29,18.85 17.83,19.3 17.53,19.3 14.94,16.71 14.94,12.29 v13.72,11.07
N$25  (via drill 0.3)
  Top 0.152: v34.44,24.18 34.44,23.11 R27.1 | v34.44,27.23 34.44,26.16 C26.1 | U$7.4 32.77,30.12 v34.44,30.12 35.51,30.12 38.86,26.77 38.86,25.55 39.01,25.4 40.39,25.4 41.15,26.16 41.15,26.62 41.45,26.92 42.98,26.92 43.74,26.16 R28.2
  Bottom 0.152: v34.44,24.18 v34.44,27.23 v34.44,30.12
N$27
  Top 0.152: U$8.4 52.88,25.4 52.88,23.88 53.34,23.42 53.34,20.52 52.73,19.91 C31.2 52.58,19.91 51.82,20.68 50.44,20.68 49.99,20.22 48.31,20.22 47.4,21.13 47.4,21.29 46.94,21.74 C30.1
RESET  (via drill 0.3)
  Top 0.152: v17.37,26.92 17.37,24.79 17.98,24.18 18.59,24.18 U$2.15
  Bottom 0.152: v17.37,26.92 25.15,26.92 32,33.78 37.49,33.78 38.41,32.87 43.28,32.87 43.89,33.48 43.89,35.61 44.5,36.22 45.41,36.22 45.87,35.76 45.87,27.99 52.27,21.59 52.27,9.86 50.6,8.18 JP1.12
RX  (via drill 0.3)
  Top 0.152: v28.96,9.86 28.96,14.43 28.35,15.04 27.13,15.04 26.36,15.8 26.36,16.26 U$2.50
  Bottom 0.152: v28.96,9.86 28.65,9.86 24.99,6.2 9.91,6.2 SV1.4
SCKA  (via drill 0.3)
  Top 0.152: v24.84,26.31 25.3,25.86 25.3,25.4 U$2.29 | v34.14,17.48 35.36,17.48 44.65,8.18 45.41,8.18 JP1.8
  Bottom 0.152: v24.84,26.31 21.49,26.31 20.88,25.7 18.9,25.7 18.75,25.86 18.44,25.86 17.98,25.4 17.98,25.09 25.6,17.48 v34.14,17.48
SDIA  (via drill 0.3)
  Top 0.152: v28.35,26.01 26.52,26.01 26.36,25.86 26.36,25.4 U$2.31 | v34.14,20.22 34.59,20.22 v35.36,19.46
  Bottom 0.152: v34.14,20.22 v28.35,26.01 | v35.36,19.46 35.36,13.66 36.73,12.29 36.73,5.28 37.49,4.52 43.28,4.52 44.35,5.59 44.35,5.89 45.57,7.11 47.09,7.11 48.01,8.03 JP1.10
SDOA  (via drill 0.3)
  Top 0.152: v30.94,25.25 26.98,25.25 U$2.32
  Bottom 0.152: v30.94,25.25 38.25,17.93 45.87,17.93 48.31,15.49 48.31,9.25 49.53,8.03 49.53,6.5 50.44,5.59 JP1.11
TX  (via drill 0.3)
  Top 0.152: v31.7,12.14 27.58,16.26 26.98,16.26 U$2.49
  Bottom 0.152: v31.7,12.14 31.7,10.31 25.6,4.22 9.3,4.22 7.47,6.04 SV1.3
VCC  (via drill 0.3)
  Top 0.152: 31.39,31.04 31.39,32.72 C23.2 | 31.39,31.04 31.39,29.67 30.94,29.21 30.94,27.69 U$7.1 | 39.01,27.08 35.05,31.04 31.39,31.04 | 39.01,27.08 39.62,26.47 39.62,26.16 R25.2 | v36.88,18.54 38.56,18.54 39.32,17.78 R2.2 | 44.2,17.78 43.59,17.78 R1.2 | v44.65,17.32 44.2,17.78 | v39.17,27.23 39.01,27.08 | v45.72,20.22 45.72,19.3 44.2,17.78
  Bottom 0.152: 36.88,17.32 36.88,12.6 37.8,11.68 37.8,8.18 JP1.2 37.95,8.03 37.95,5.59 JP1.1 | 36.88,17.32 v36.88,18.54 | 36.88,17.32 v44.65,17.32 | v39.17,27.23 39.17,26.77 v45.72,20.22
VDD12_EN  (via drill 0.3)
  Top 0.152: v18.59,25.25 18.59,24.64 U$2.16 | v34.14,18.24 35.05,18.24 36.58,16.71 41,16.71 41.3,16.41 46.02,16.41 47.09,17.48 47.09,18.69 R29.1 47.24,18.85 47.55,19.15 v47.55,19.76 | v51.66,21.44 52.73,22.5 52.73,22.81 U$8.3 | v45.57,21.44 43.89,23.11 R30.2
  Bottom 0.152: v18.59,25.25 28.35,25.25 34.44,19.15 34.44,18.54 v34.14,18.24 | v51.66,21.44 49.23,21.44 v47.55,19.76 45.87,21.44 v45.57,21.44
WSA  (via drill 0.3)
  Top 0.152: v25.76,26.31 25.76,25.4 U$2.30 | v37.34,33.17 38.1,33.17 41.76,29.52 42.22,29.52 42.37,29.36 42.37,28.14 42.67,27.84 43.74,27.84 45.87,29.97 45.87,35.61 46.48,36.22 47.4,36.22 53.8,29.82 53.8,12.9 49.07,8.18 49.07,6.66 JP1.9
  Bottom 0.152: v25.76,26.31 25.76,27.08 31.85,33.17 v37.34,33.17
XI
  Top 0.152: U$2.22 21.95,25.4 21.95,28.3 22.1,28.45 Y1.1 22.1,28.6 20.27,30.43 19.96,30.43 C1.2
XO
  Top 0.152: U$2.23 22.4,25.4 22.4,27.23 23.62,28.45 23.62,29.52 24.38,30.28 Y1.3 24.54,30.28 25.15,29.67 27.13,29.67 27.89,30.43 28.19,30.43 C2.2

### Text on the board
tPlace: ZL38063 Dev Board | Rev.Beta | Designed in Aizu | VCC | GND | IN | SCK | DIA | RST | VCC | CLK | CS | OUT | WSA | DOA | VCC | GND | TX | RX